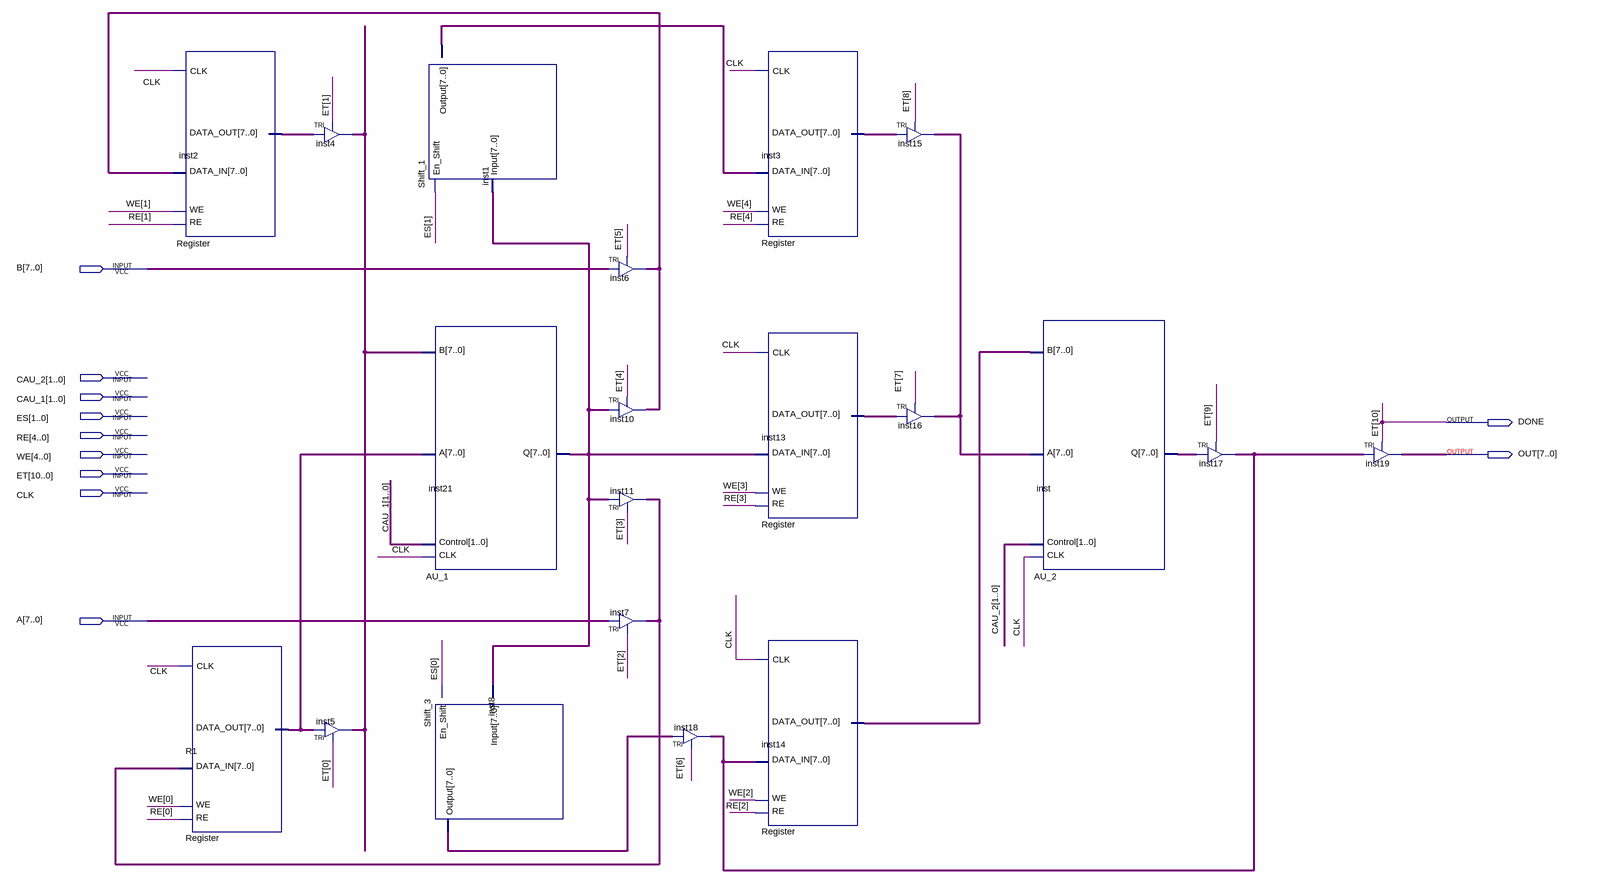
[diagram p0: schematic sheet]
// Quartus schematic Datapath.bdf as structural Verilog: 20 symbols, 11 pins
module Datapath (
  input  [7:0] B,
  input  [1:0] CAU_2,
  input  [1:0] CAU_1,
  input  [1:0] ES,
  input  [4:0] RE,
  input  [4:0] WE,
  input  [10:0] ET,
  input  CLK,
  input  [7:0] A,
  output DONE,
  output [7:0] OUT
);

  wire [7:0] inst1_output, inst2_data_out, inst3_data_out, inst4_out, inst6_out, inst8_output, inst11_out,
       inst13_data_out, inst14_data_out, inst15_out, inst18_out, inst21_q, inst_q, R1_data_out;

  Register inst2 (.RE(RE[1]), .WE(WE[1]), .DATA_IN(inst6_out), .CLK(CLK), .DATA_OUT(inst2_data_out));
  Register R1 (.RE(RE[0]), .WE(WE[0]), .DATA_IN(inst11_out), .CLK(CLK), .DATA_OUT(R1_data_out));
  TRI inst4[7:0] (.IN(inst2_data_out), .OE(ET[1]), .OUT(inst4_out));
  TRI inst5[7:0] (.IN(R1_data_out), .OE(ET[0]), .OUT(inst4_out));
  Shift_1 inst1 (.Input(inst21_q), .En_Shift(ES[1]), .Output(inst1_output));
  AU_1 inst21 (.B(inst4_out), .Control(CAU_1), .A(R1_data_out), .CLK(CLK), .Q(inst21_q));
  Shift_3 inst8 (.Input(inst21_q), .En_Shift(ES[0]), .Output(inst8_output));
  TRI inst6[7:0] (.IN(B), .OE(ET[5]), .OUT(inst6_out));
  TRI inst10[7:0] (.IN(inst21_q), .OE(ET[4]), .OUT(inst6_out));
  TRI inst11[7:0] (.IN(inst21_q), .OE(ET[3]), .OUT(inst11_out));
  TRI inst7[7:0] (.IN(A), .OE(ET[2]), .OUT(inst11_out));
  TRI inst18[7:0] (.IN(inst8_output), .OE(ET[6]), .OUT(inst18_out));
  Register inst3 (.RE(RE[4]), .WE(WE[4]), .DATA_IN(inst1_output), .CLK(CLK), .DATA_OUT(inst3_data_out));
  Register inst13 (.RE(RE[3]), .WE(WE[3]), .DATA_IN(inst21_q), .CLK(CLK), .DATA_OUT(inst13_data_out));
  Register inst14 (.RE(RE[2]), .WE(WE[2]), .DATA_IN(inst18_out), .CLK(CLK), .DATA_OUT(inst14_data_out));
  TRI inst15[7:0] (.IN(inst3_data_out), .OE(ET[8]), .OUT(inst15_out));
  TRI inst16[7:0] (.IN(inst13_data_out), .OE(ET[7]), .OUT(inst15_out));
  AU_2 inst (.Control(CAU_2), .A(inst15_out), .B(inst14_data_out), .CLK(CLK), .Q(inst_q));
  TRI inst17[7:0] (.IN(inst_q), .OE(ET[9]), .OUT(inst18_out));
  TRI inst19[7:0] (.IN(inst18_out), .OE(ET[10]), .OUT(OUT));

  assign DONE = ET[10];
endmodule
